# EAGLE design breakout (EAGLE 7.5.0)

## Sheet 1 of 2
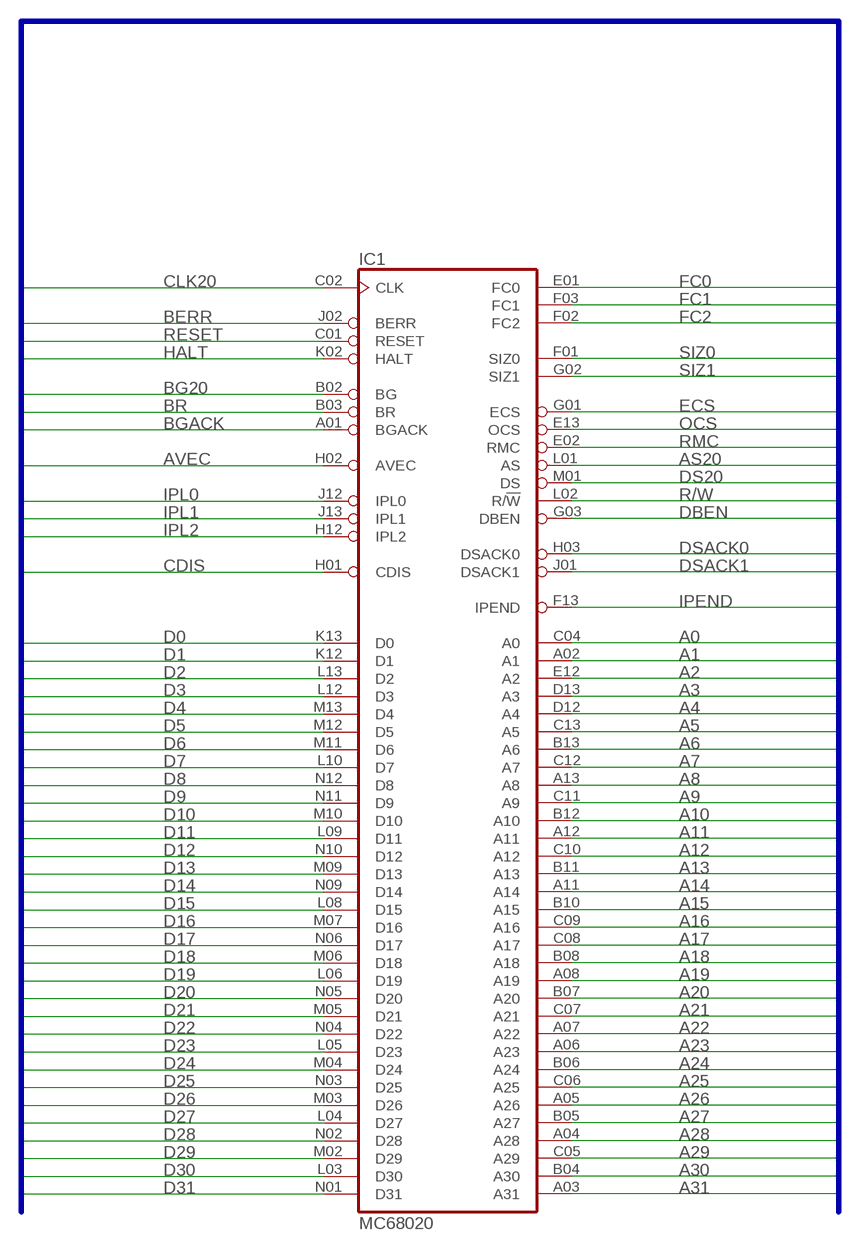
[diagram p0: schematic, sheet 1]

### Parts
IC1  MC68020  MC68020RC  [MPGA114]

### Nets
A0: IC1.C04(A0) ; also sheet 2
A1: IC1.A02(A1) ; also sheet 2
A2: IC1.E12(A2) ; also sheet 2
A3: IC1.D13(A3) ; also sheet 2
A4: IC1.D12(A4) ; also sheet 2
A5: IC1.C13(A5) ; also sheet 2
A6: IC1.B13(A6) ; also sheet 2
A7: IC1.C12(A7) ; also sheet 2
A8: IC1.A13(A8) ; also sheet 2
A9: IC1.C11(A9) ; also sheet 2
A10: IC1.B12(A10) ; also sheet 2
A11: IC1.A12(A11) ; also sheet 2
A12: IC1.C10(A12) ; also sheet 2
A13: IC1.B11(A13) ; also sheet 2
A14: IC1.A11(A14) ; also sheet 2
A15: IC1.B10(A15) ; also sheet 2
A16: IC1.C09(A16) ; also sheet 2
A17: IC1.C08(A17) ; also sheet 2
A18: IC1.B08(A18) ; also sheet 2
A19: IC1.A08(A19) ; also sheet 2
A20: IC1.B07(A20) ; also sheet 2
A21: IC1.C07(A21) ; also sheet 2
A22: IC1.A07(A22) ; also sheet 2
A23: IC1.A06(A23) ; also sheet 2
A24: IC1.B06(A24) ; also sheet 2
A25: IC1.C06(A25) ; also sheet 2
A26: IC1.A05(A26) ; also sheet 2
A27: IC1.B05(A27) ; also sheet 2
A28: IC1.A04(A28) ; also sheet 2
A29: IC1.C05(A29) ; also sheet 2
A30: IC1.B04(A30) ; also sheet 2
A31: IC1.A03(A31) ; also sheet 2
AS20: IC1.L01(AS) ; also sheet 2
AVEC: IC1.H02(AVEC) ; also sheet 2
BERR: IC1.J02(BERR) ; also sheet 2
BG20: IC1.B02(BG) ; also sheet 2
BGACK: IC1.A01(BGACK) ; also sheet 2
BR: IC1.B03(BR) ; also sheet 2
CDIS: IC1.H01(CDIS) ; also sheet 2
CLK20: IC1.C02(CLK) ; also sheet 2
D0: IC1.K13(D0) ; also sheet 2
D1: IC1.K12(D1) ; also sheet 2
D2: IC1.L13(D2) ; also sheet 2
D3: IC1.L12(D3) ; also sheet 2
D4: IC1.M13(D4) ; also sheet 2
D5: IC1.M12(D5) ; also sheet 2
D6: IC1.M11(D6) ; also sheet 2
D7: IC1.L10(D7) ; also sheet 2
D8: IC1.N12(D8) ; also sheet 2
D9: IC1.N11(D9) ; also sheet 2
D10: IC1.M10(D10) ; also sheet 2
D11: IC1.L09(D11) ; also sheet 2
D12: IC1.N10(D12) ; also sheet 2
D13: IC1.M09(D13) ; also sheet 2
D14: IC1.N09(D14) ; also sheet 2
D15: IC1.L08(D15) ; also sheet 2
D16: IC1.M07(D16) ; also sheet 2
D17: IC1.N06(D17) ; also sheet 2
D18: IC1.M06(D18) ; also sheet 2
D19: IC1.L06(D19) ; also sheet 2
D20: IC1.N05(D20) ; also sheet 2
D21: IC1.M05(D21) ; also sheet 2
D22: IC1.N04(D22) ; also sheet 2
D23: IC1.L05(D23) ; also sheet 2
D24: IC1.M04(D24) ; also sheet 2
D25: IC1.N03(D25) ; also sheet 2
D26: IC1.M03(D26) ; also sheet 2
D27: IC1.L04(D27) ; also sheet 2
D28: IC1.N02(D28) ; also sheet 2
D29: IC1.M02(D29) ; also sheet 2
D30: IC1.L03(D30) ; also sheet 2
D31: IC1.N01(D31) ; also sheet 2
DBEN: IC1.G03(DBEN) ; also sheet 2
DS20: IC1.M01(DS) ; also sheet 2
DSACK0: IC1.H03(DSACK0) ; also sheet 2
DSACK1: IC1.J01(DSACK1) ; also sheet 2
ECS: IC1.G01(ECS) ; also sheet 2
FC0: IC1.E01(FC0) ; also sheet 2
FC1: IC1.F03(FC1) ; also sheet 2
FC2: IC1.F02(FC2) ; also sheet 2
HALT: IC1.K02(HALT) ; also sheet 2
IPEND: IC1.F13(IPEND) ; also sheet 2
IPL0: IC1.J12(IPL0) ; also sheet 2
IPL1: IC1.J13(IPL1) ; also sheet 2
IPL2: IC1.H12(IPL2) ; also sheet 2
OCS: IC1.E13(OCS) ; also sheet 2
R/W: IC1.L02(R/!W) ; also sheet 2
RESET: IC1.C01(RESET) ; also sheet 2
RMC: IC1.E02(RMC) ; also sheet 2
SIZ0: IC1.F01(SIZ0) ; also sheet 2
SIZ1: IC1.G02(SIZ1) ; also sheet 2

### Buses
VCC33,VCC,GND,CLK7M,A[0..31],D[0..31],IPL[0..2],FC[0..2],DSACK[0..1],BR,BGACK,R/W,CLK20,AS20,DS20,BG20,AVEC,SIZ[0..1],DBEN,BERR,RESET,HALT,BG,VPA,VMA,E,AS,CDIS,UDS,LDS,DTACK,ECS,OCS,RMC,IPEND

## Sheet 2 of 2
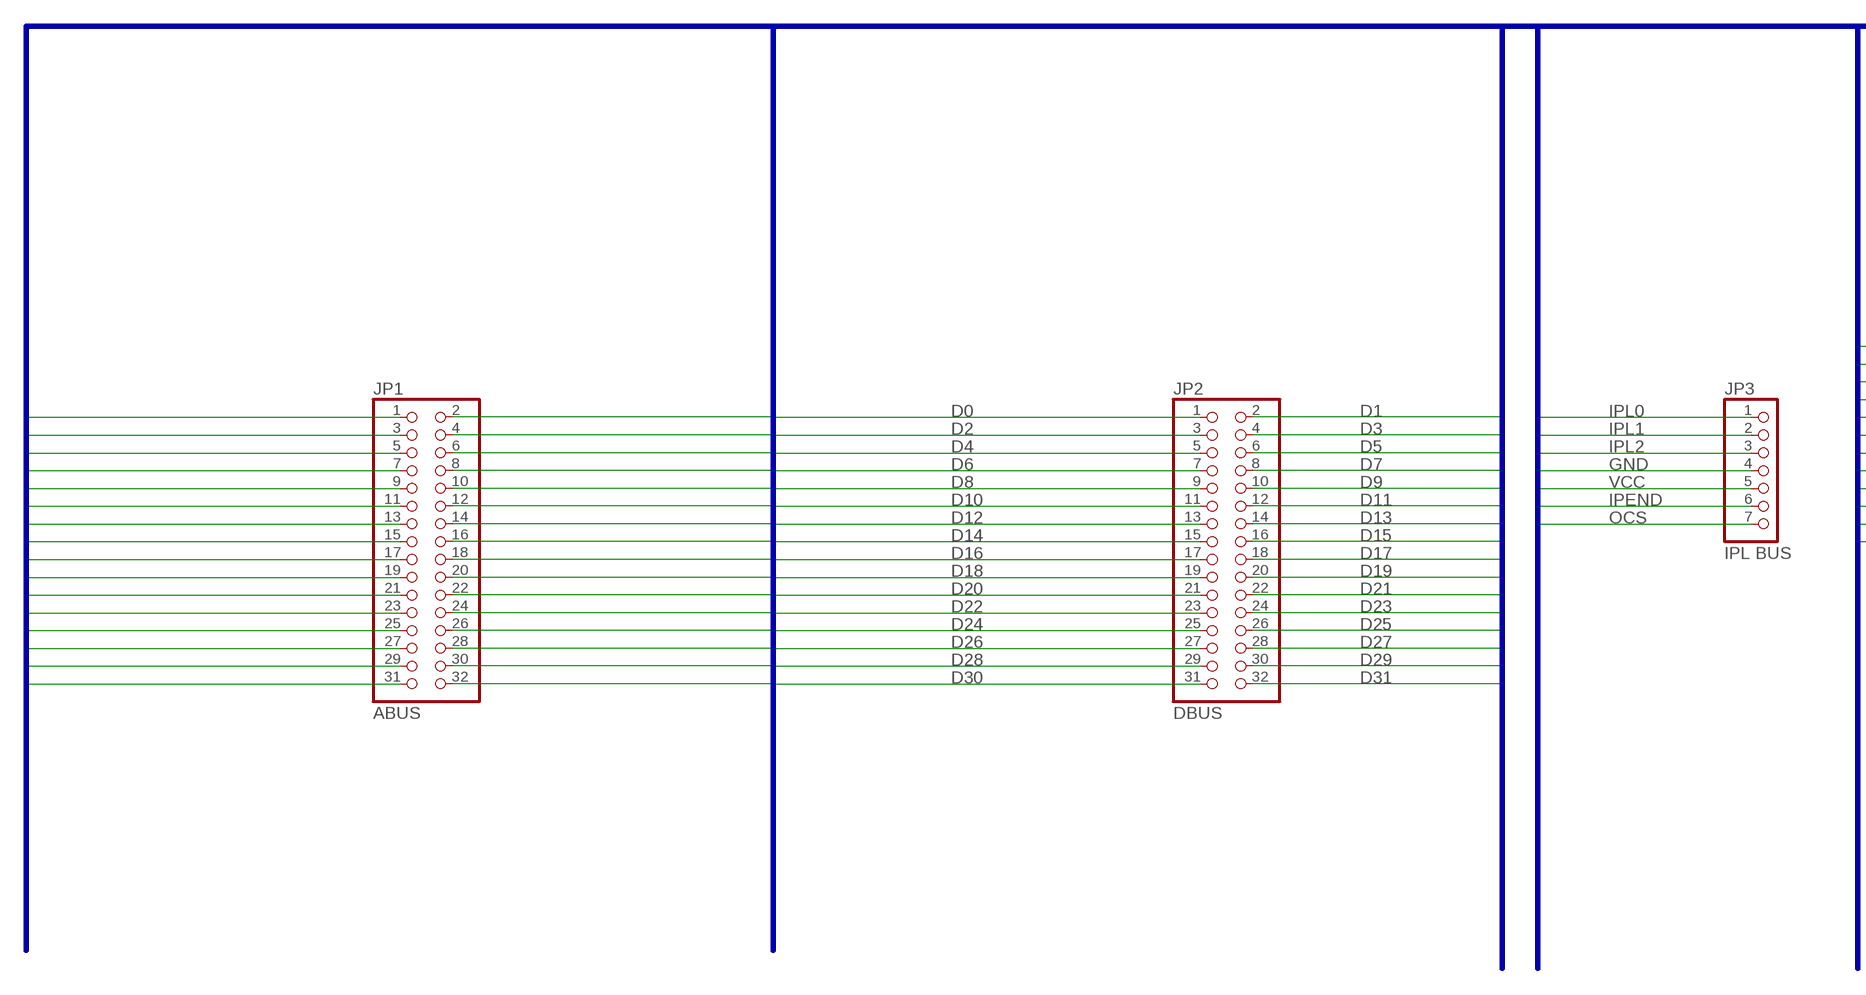
[diagram p1: schematic, sheet 2, part 1 of 2]
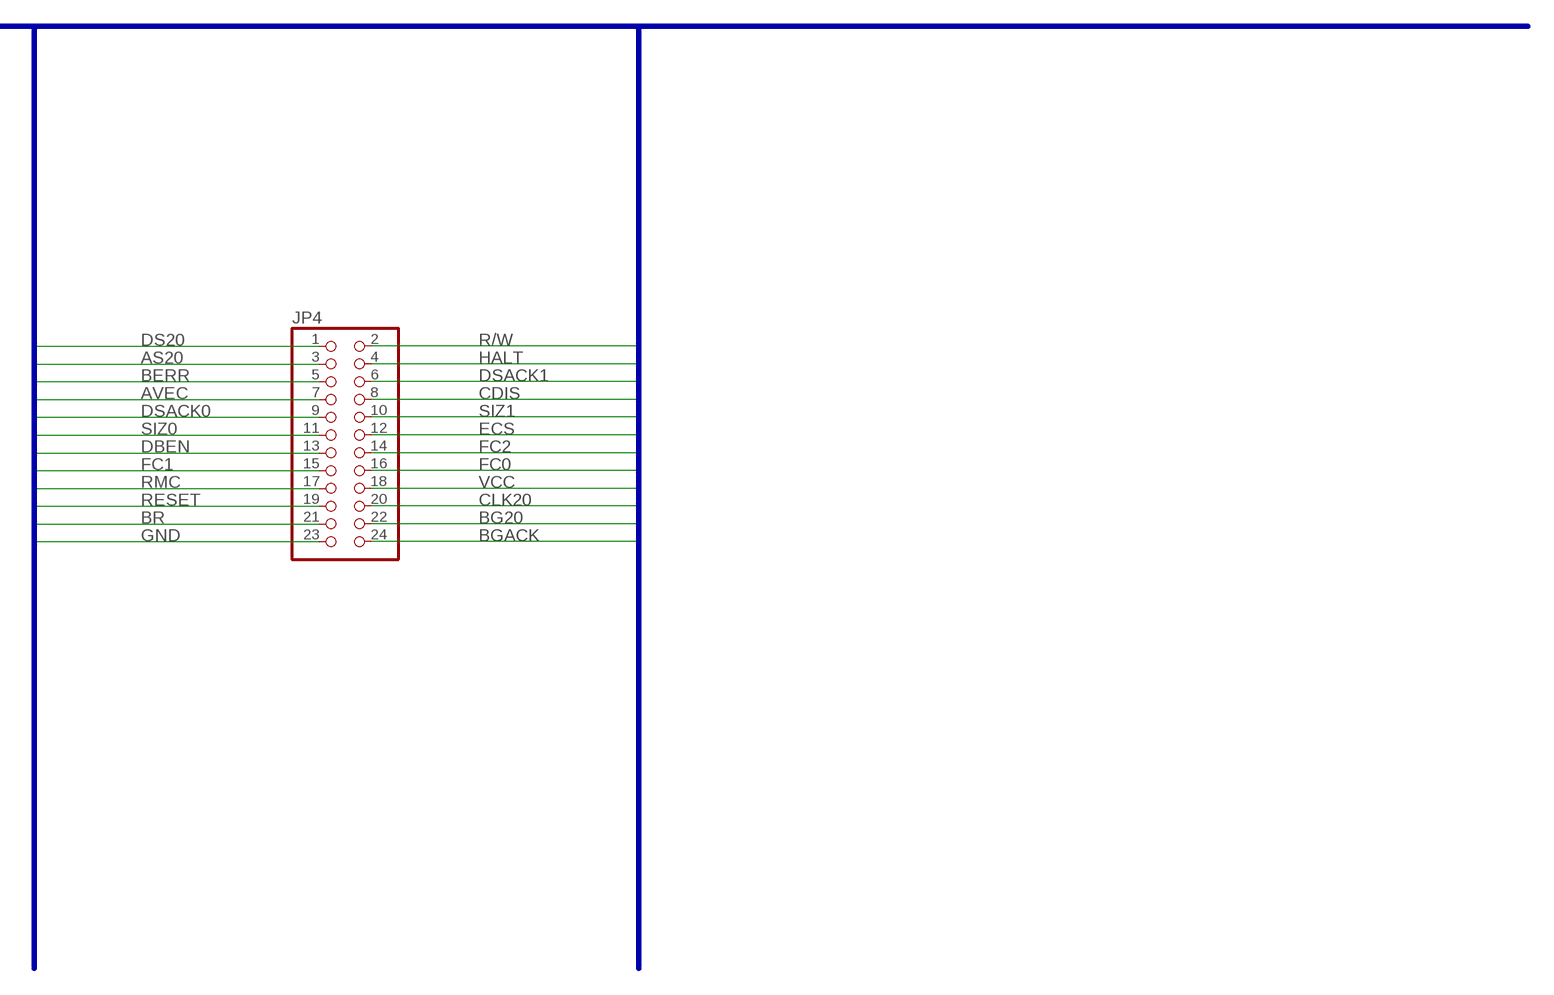
[diagram p2: schematic, sheet 2, part 2 of 2]

### Parts
JP1  ABUS  PINHD-2X16  [2X16]
JP2  DBUS  PINHD-2X16  [2X16]
JP3  IPL BUS  PINHD-1X7  [1X07]
JP4  PINHD-2X12  [2X12]

### Nets
A0: JP1.1 ; also sheet 1
A1: JP1.2 ; also sheet 1
A2: JP1.3 ; also sheet 1
A3: JP1.4 ; also sheet 1
A4: JP1.5 ; also sheet 1
A5: JP1.6 ; also sheet 1
A6: JP1.7 ; also sheet 1
A7: JP1.8 ; also sheet 1
A8: JP1.9 ; also sheet 1
A9: JP1.10 ; also sheet 1
A10: JP1.11 ; also sheet 1
A11: JP1.12 ; also sheet 1
A12: JP1.13 ; also sheet 1
A13: JP1.14 ; also sheet 1
A14: JP1.15 ; also sheet 1
A15: JP1.16 ; also sheet 1
A16: JP1.17 ; also sheet 1
A17: JP1.18 ; also sheet 1
A18: JP1.19 ; also sheet 1
A19: JP1.20 ; also sheet 1
A20: JP1.21 ; also sheet 1
A21: JP1.22 ; also sheet 1
A22: JP1.23 ; also sheet 1
A23: JP1.24 ; also sheet 1
A24: JP1.25 ; also sheet 1
A25: JP1.26 ; also sheet 1
A26: JP1.27 ; also sheet 1
A27: JP1.28 ; also sheet 1
A28: JP1.29 ; also sheet 1
A29: JP1.30 ; also sheet 1
A30: JP1.31 ; also sheet 1
A31: JP1.32 ; also sheet 1
AS20: JP4.3 ; also sheet 1
AVEC: JP4.7 ; also sheet 1
BERR: JP4.5 ; also sheet 1
BG20: JP4.22 ; also sheet 1
BGACK: JP4.24 ; also sheet 1
BR: JP4.21 ; also sheet 1
CDIS: JP4.8 ; also sheet 1
CLK20: JP4.20 ; also sheet 1
D0: JP2.1 ; also sheet 1
D1: JP2.2 ; also sheet 1
D2: JP2.3 ; also sheet 1
D3: JP2.4 ; also sheet 1
D4: JP2.5 ; also sheet 1
D5: JP2.6 ; also sheet 1
D6: JP2.7 ; also sheet 1
D7: JP2.8 ; also sheet 1
D8: JP2.9 ; also sheet 1
D9: JP2.10 ; also sheet 1
D10: JP2.11 ; also sheet 1
D11: JP2.12 ; also sheet 1
D12: JP2.13 ; also sheet 1
D13: JP2.14 ; also sheet 1
D14: JP2.15 ; also sheet 1
D15: JP2.16 ; also sheet 1
D16: JP2.17 ; also sheet 1
D17: JP2.18 ; also sheet 1
D18: JP2.19 ; also sheet 1
D19: JP2.20 ; also sheet 1
D20: JP2.21 ; also sheet 1
D21: JP2.22 ; also sheet 1
D22: JP2.23 ; also sheet 1
D23: JP2.24 ; also sheet 1
D24: JP2.25 ; also sheet 1
D25: JP2.26 ; also sheet 1
D26: JP2.27 ; also sheet 1
D27: JP2.28 ; also sheet 1
D28: JP2.29 ; also sheet 1
D29: JP2.30 ; also sheet 1
D30: JP2.31 ; also sheet 1
D31: JP2.32 ; also sheet 1
DBEN: JP4.13 ; also sheet 1
DS20: JP4.1 ; also sheet 1
DSACK0: JP4.9 ; also sheet 1
DSACK1: JP4.6 ; also sheet 1
ECS: JP4.12 ; also sheet 1
FC0: JP4.16 ; also sheet 1
FC1: JP4.15 ; also sheet 1
FC2: JP4.14 ; also sheet 1
GND: JP3.4 JP4.23
HALT: JP4.4 ; also sheet 1
IPEND: JP3.6 ; also sheet 1
IPL0: JP3.1 ; also sheet 1
IPL1: JP3.2 ; also sheet 1
IPL2: JP3.3 ; also sheet 1
OCS: JP3.7 ; also sheet 1
R/W: JP4.2 ; also sheet 1
RESET: JP4.19 ; also sheet 1
RMC: JP4.17 ; also sheet 1
SIZ0: JP4.11 ; also sheet 1
SIZ1: JP4.10 ; also sheet 1
VCC: JP3.5 JP4.18

### Buses
VCC33,VCC,GND,CLK7M,A[0..31],D[0..31],IPL[0..2],FC[0..2],DSACK[0..1],BR,BGACK,R/W,CLK20,AS20,DS20,BG20,AVEC,SIZ[0..1],DBEN,BERR,RESET,HALT,BG,VPA,VMA,E,AS,CDIS,UDS,LDS,DTACK,ECS,OCS,RMC,IPEND

## Power pins joined to a net without a drawn wire
GND: IC1.A10(GND) IC1.B01(GND) IC1.B09(GND) IC1.C03(GND) IC1.F12(GND) IC1.G12(GND) IC1.H13(GND) IC1.J03(GND) IC1.K01(GND) IC1.K03(GND) IC1.L07(GND) IC1.L11(GND) IC1.N07(GND)
VCC: IC1.A09(VCC) IC1.D01(VCC) IC1.D02(VCC) IC1.D03(VCC) IC1.E03(VCC) IC1.G11(VCC) IC1.G13(VCC) IC1.M08(VCC) IC1.N08(VCC) IC1.N13(VCC)

## Library data of the parts
IC1 = micro-mc68000:MC68020RC: 68xxx PROCESSOR; MF: MOTOROLA; MPN: MC68020RC33E; OC_FARNELL: 1579779; OC_NEWARK: 66F7091
JP1 JP2 = pinhead:PINHD-2X16: PIN HEADER
JP3 = pinhead:PINHD-1X7: PIN HEADER
JP4 = pinhead:PINHD-2X12: PIN HEADER

## Board
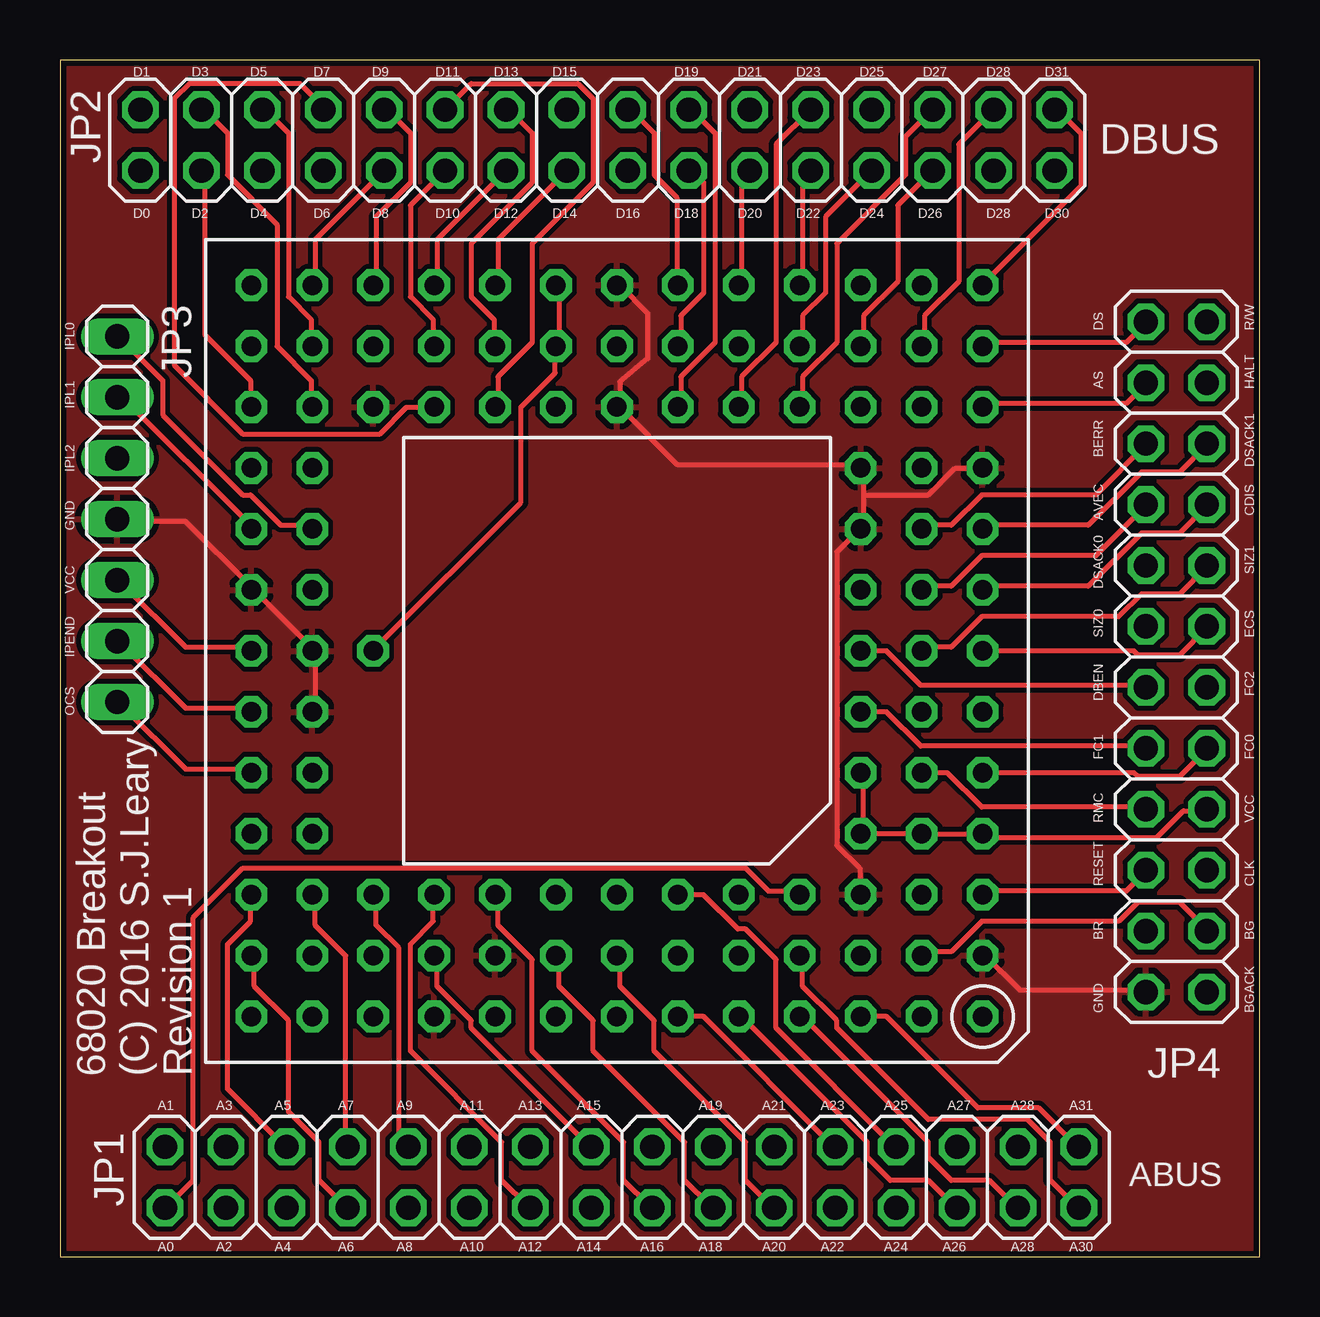
[diagram p3: board, top side]
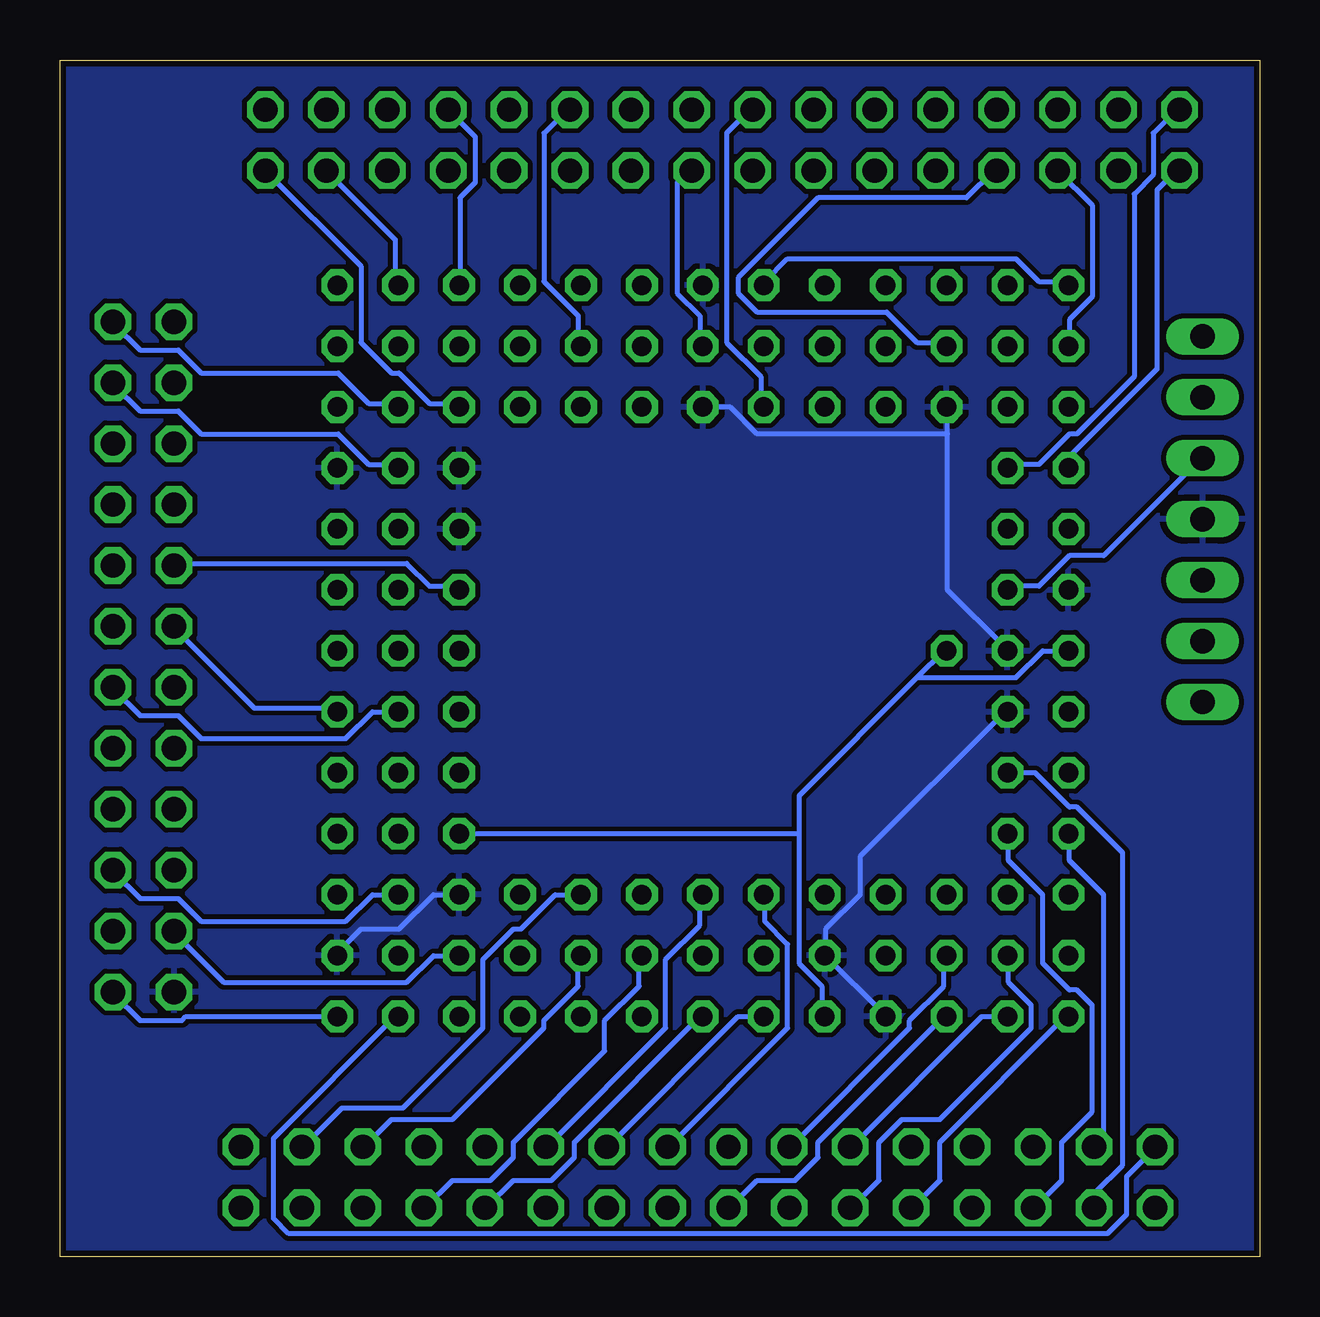
[diagram p4: board, bottom side, seen from below]

Size 50.01 x 49.88 mm. Coordinates in mm from the lower left corner, seen from the top.
Outline: 0,0 50.01,0 50.01,49.88 0,49.88 0,0
Copper layers (1*16): Top 0.035mm / dielectric 1.5mm / Bottom 0.035mm
Design rules "dirt_cheap_dirty_boards.v1 *": minimum track width 5mil, minimum drill 12mil, track to track 8mil, track to pad 8mil, pad to pad 8mil, via to via 8mil, smd to smd 0mil, copper to edge 10mil, drill to drill 10mil, minimum pad ring 10mil, minimum via ring 6mil, stop-mask expansion 2mil, vias tented up to drill 25mil, thermal gap 10mil

### Footprints (pad centres in the part's own frame; a part is rotated, then mirrored left to right if it is on the bottom)
MPGA114 = drill 0.813 octagon: A01 -15.24,15.24; A02 -12.7,15.24; A03 -10.16,15.24; A04 -7.62,15.24; A05 -5.08,15.24; A06 -2.54,15.24; A07 0,15.24; A08 2.54,15.24; A09 5.08,15.24; A10 7.62,15.24; A11 10.16,15.24; A12 12.7,15.24; A13 15.24,15.24; B01 -15.24,12.7; B02 -12.7,12.7; B03 -10.16,12.7; B04 -7.62,12.7; B05 -5.08,12.7; B06 -2.54,12.7; B07 0,12.7; B08 2.54,12.7; B09 5.08,12.7; B10 7.62,12.7; B11 10.16,12.7; B12 12.7,12.7; B13 15.24,12.7; C01 -15.24,10.16; C02 -12.7,10.16; C03 -10.16,10.16; C04 -7.62,10.16; C05 -5.08,10.16; C06 -2.54,10.16; C07 0,10.16; C08 2.54,10.16; C09 5.08,10.16; C10 7.62,10.16; C11 10.16,10.16; C12 12.7,10.16; C13 15.24,10.16; D01 -15.24,7.62; D02 -12.7,7.62; D03 -10.16,7.62; D12 12.7,7.62; D13 15.24,7.62; E01 -15.24,5.08; E02 -12.7,5.08; E03 -10.16,5.08; E12 12.7,5.08; E13 15.24,5.08; F01 -15.24,2.54; F02 -12.7,2.54; F03 -10.16,2.54; F12 12.7,2.54; F13 15.24,2.54; G01 -15.24,0; G02 -12.7,0; G03 -10.16,0; G11 10.16,0; G12 12.7,0; G13 15.24,0; H01 -15.24,-2.54; H02 -12.7,-2.54; H03 -10.16,-2.54; H12 12.7,-2.54; H13 15.24,-2.54; J01 -15.24,-5.08; J02 -12.7,-5.08; J03 -10.16,-5.08; J12 12.7,-5.08; J13 15.24,-5.08; K01 -15.24,-7.62; K02 -12.7,-7.62; K03 -10.16,-7.62; K12 12.7,-7.62; K13 15.24,-7.62; L01 -15.24,-10.16; L02 -12.7,-10.16; L03 -10.16,-10.16; L04 -7.62,-10.16; L05 -5.08,-10.16; L06 -2.54,-10.16; L07 0,-10.16; L08 2.54,-10.16; L09 5.08,-10.16; L10 7.62,-10.16; L11 10.16,-10.16; L12 12.7,-10.16; L13 15.24,-10.16; M01 -15.24,-12.7; M02 -12.7,-12.7; M03 -10.16,-12.7; M04 -7.62,-12.7; M05 -5.08,-12.7; M06 -2.54,-12.7; M07 0,-12.7; M08 2.54,-12.7; M09 5.08,-12.7; M10 7.62,-12.7; M11 10.16,-12.7; M12 12.7,-12.7; M13 15.24,-12.7; N01 -15.24,-15.24; N02 -12.7,-15.24; N03 -10.16,-15.24; N04 -7.62,-15.24; N05 -5.08,-15.24; N06 -2.54,-15.24; N07 0,-15.24; N08 2.54,-15.24; N09 5.08,-15.24; N10 7.62,-15.24; N11 10.16,-15.24; N12 12.7,-15.24; N13 15.24,-15.24
2X16 = drill 1.016 octagon: 1 -19.05,-1.27; 2 -19.05,1.27; 3 -16.51,-1.27; 4 -16.51,1.27; 5 -13.97,-1.27; 6 -13.97,1.27; 7 -11.43,-1.27; 8 -11.43,1.27; 9 -8.89,-1.27; 10 -8.89,1.27; 11 -6.35,-1.27; 12 -6.35,1.27; 13 -3.81,-1.27; 14 -3.81,1.27; 15 -1.27,-1.27; 16 -1.27,1.27; 17 1.27,-1.27; 18 1.27,1.27; 19 3.81,-1.27; 20 3.81,1.27; 21 6.35,-1.27; 22 6.35,1.27; 23 8.89,-1.27; 24 8.89,1.27; 25 11.43,-1.27; 26 11.43,1.27; 27 13.97,-1.27; 28 13.97,1.27; 29 16.51,-1.27; 30 16.51,1.27; 31 19.05,-1.27; 32 19.05,1.27
1X07 = drill 1.016 long: 1 -7.62,0; 2 -5.08,0; 3 -2.54,0; 4 0,0; 5 2.54,0; 6 5.08,0; 7 7.62,0
2X12 = drill 1.016 octagon: 1 -13.97,-1.27; 2 -13.97,1.27; 3 -11.43,-1.27; 4 -11.43,1.27; 5 -8.89,-1.27; 6 -8.89,1.27; 7 -6.35,-1.27; 8 -6.35,1.27; 9 -3.81,-1.27; 10 -3.81,1.27; 11 -1.27,-1.27; 12 -1.27,1.27; 13 1.27,-1.27; 14 1.27,1.27; 15 3.81,-1.27; 16 3.81,1.27; 17 6.35,-1.27; 18 6.35,1.27; 19 8.89,-1.27; 20 8.89,1.27; 21 11.43,-1.27; 22 11.43,1.27; 23 13.97,-1.27; 24 13.97,1.27

### Placement (x,y rotation side)
IC1  23.22,25.25 180 top
JP1  23.42,3.3 0 top
JP2  22.4,46.53 0 top
JP3  2.39,30.73 270 top
JP4  46.53,24.99 270 top

### Tracks (layer width: path | path; a pad name or v marks a point on that pad's centre or on a via)
A0
  Top 0.203: IC1.C04 30.8,15.24 29.53,15.24 28.57,16.19 7.62,16.19 5.56,14.13 5.56,3.17 4.45,2.06 JP1.1
A1
  Bottom 0.203: IC1.A02 36.04,10 41.12,4.92 41.12,1.59 40.48,0.95 6.35,0.95 5.56,1.75 5.56,3.33 4.45,4.45 JP1.2
A2
  Bottom 0.203: IC1.E12 10.48,20.16 9.37,20.16 7.94,18.73 7.62,18.73 5.71,16.83 5.71,3.81 6.83,2.7 6.83,2.06 JP1.3
A3
  Bottom 0.203: IC1.D13 7.94,17.62 7.94,16.51 6.51,15.08 6.51,4.92 6.83,4.6 JP1.4
A4
  Bottom 0.203: IC1.D12 10.48,17.62 10.48,16.51 9.05,15.08 9.05,12.22 7.94,11.11 7.62,11.11 6.99,10.48 6.99,6.03 8.26,4.76 8.26,3.17 9.37,2.06 JP1.5
A5
  Top 0.203: IC1.C13 7.94,15.08 7.94,13.97 6.99,13.02 6.99,6.99 9.37,4.6 JP1.6
A6
  Top 0.203: IC1.B13 8.1,12.54 8.1,11.27 9.53,9.84 9.53,6.03 10.79,4.76 10.79,3.17 11.91,2.06 JP1.7
A7
  Top 0.203: IC1.C12 10.64,15.08 10.64,13.81 11.91,12.54 11.91,4.6 JP1.8
A8
  Bottom 0.203: IC1.A13 8.1,10 13.34,4.76 13.34,3.17 14.45,2.06 JP1.9
A9
  Top 0.203: IC1.C11 13.18,15.08 13.18,13.81 14.13,12.86 14.13,4.92 14.45,4.6 JP1.10
A10
  Bottom 0.203: IC1.B12 10.48,12.54 10.48,11.43 9.53,10.48 9.53,9.53 13.34,5.71 14.92,5.71 15.88,4.76 15.88,3.17 16.99,2.06 JP1.11
A11
  Bottom 0.203: IC1.A12 10.64,10 11.59,10 16.99,4.6 JP1.12
A12
  Top 0.203: IC1.C10 15.56,15.08 15.56,13.97 14.61,13.02 14.61,8.57 18.41,4.76 18.41,3.17 19.53,2.06 JP1.13
A13
  Bottom 0.203: IC1.B11 13.18,12.54 13.18,11.27 14.61,9.84 14.61,9.53 19.53,4.6 JP1.14
A14
  Bottom 0.203: IC1.A11 13.18,10 18.41,4.76 18.41,4.13 19.37,3.17 20.95,3.17 22.07,2.06 JP1.15
A15
  Top 0.203: IC1.B10 15.72,12.54 15.72,11.27 17.14,9.84 17.14,9.53 22.07,4.6 JP1.16
A16
  Top 0.203: IC1.C09 18.26,15.08 18.26,13.81 19.68,12.38 19.68,8.57 23.5,4.76 23.5,3.17 24.61,2.06 JP1.17
A17
  Bottom 0.203: IC1.C08 20.64,15.08 20.64,13.97 19.68,13.02 19.68,9.53 24.61,4.6 JP1.18
A18
  Top 0.203: IC1.B08 20.8,12.54 20.8,11.27 22.23,9.84 22.23,8.57 26.04,4.76 26.04,3.17 27.15,2.06 JP1.19
A19
  Bottom 0.203: IC1.A08 20.8,10 21.75,10 27.15,4.6 JP1.20
A20
  Top 0.203: IC1.B07 23.34,12.54 23.34,11.27 24.77,9.84 24.77,8.57 28.57,4.76 28.57,3.17 29.69,2.06 JP1.21
A21
  Bottom 0.203: IC1.C07 23.34,15.08 23.34,13.81 24.77,12.38 24.77,9.53 29.69,4.6 JP1.22
A22
  Bottom 0.203: IC1.A07 23.34,10 28.57,4.76 28.57,4.13 29.53,3.17 31.11,3.17 32.23,2.06 JP1.23
A23
  Top 0.203: IC1.A06 25.88,10 26.83,10 32.23,4.6 JP1.24
A24
  Bottom 0.203: IC1.B06 25.88,12.54 25.88,11.27 27.3,9.84 27.3,8.57 31.11,4.76 31.11,4.13 32.07,3.17 33.66,3.17 34.77,2.06 JP1.25
A25
  Top 0.203: IC1.C06 25.88,15.08 26.83,15.08 28.26,13.65 28.57,13.65 29.84,12.38 29.84,9.53 34.77,4.6 JP1.26
A26
  Top 0.203: IC1.A05 28.42,10 33.66,4.76 33.66,4.13 34.61,3.17 36.2,3.17 37.31,2.06 JP1.27
A27
  Bottom 0.203: IC1.B05 28.42,12.54 28.42,11.27 29.84,9.84 29.84,9.53 33.66,5.71 36.2,5.71 37.31,4.6 JP1.28
A28
  Top 0.203: IC1.A04 30.96,10 36.2,4.76 36.2,4.13 37.15,3.17 38.73,3.17 39.85,2.06 JP1.29
A29
  Bottom 0.203: IC1.C05 28.42,15.08 29.37,15.08 30.8,13.65 31.11,13.65 32.38,12.38 32.38,9.53 35.72,6.19 38.26,6.19 39.85,4.6 JP1.30
A30
  Top 0.203: IC1.B04 30.96,12.54 30.96,11.27 32.38,9.84 32.38,9.53 36.2,5.71 40.32,5.71 41.27,4.76 41.27,3.17 42.39,2.06 JP1.31
A31
  Top 0.203: IC1.A03 33.5,10 34.45,10 38.26,6.19 40.8,6.19 42.39,4.6 JP1.32
AS20
  Top 0.203: IC1.L01 38.58,35.56 44.45,35.56 45.24,36.35 JP4.3
AVEC
  Top 0.203: IC1.H02 36.04,27.94 37.15,27.94 38.42,29.21 43.18,29.21 45.24,31.27 JP4.7
BERR
  Top 0.203: IC1.J02 36.04,30.48 37.15,30.48 38.42,31.75 43.18,31.75 45.24,33.81 JP4.5
BG20
  Top 0.203: IC1.B02 36.04,12.7 37.15,12.7 38.42,13.97 44.13,13.97 44.93,14.76 46.67,14.76 47.78,13.65 JP4.22
BGACK
  Bottom 0.203: IC1.A01 38.58,10 44.77,10 44.93,9.84 46.67,9.84 47.78,10.95 JP4.24
BR
  Bottom 0.203: IC1.B03 33.5,12.54 34.45,12.54 35.56,11.43 43.18,11.43 45.24,13.49 JP4.21
CDIS
  Top 0.203: IC1.H01 38.58,27.94 42.86,27.94 45.09,30.16 46.67,30.16 47.78,31.27 JP4.8
CLK20
  Bottom 0.203: IC1.C02 36.04,15.08 36.99,15.08 38.1,13.97 44.13,13.97 45.09,14.92 46.67,14.92 47.78,16.03 JP4.20
D0
  Bottom 0.203: IC1.K13 7.94,33.02 7.94,33.34 4.29,36.99 4.29,44.45 3.49,45.24 JP2.1
D1
  Bottom 0.203: IC1.K12 10.48,33.02 9.21,33.02 7.94,34.29 7.62,34.29 5.24,36.67 5.24,44.29 4.45,45.09 4.45,46.83 3.49,47.78 JP2.2
D2
  Top 0.203: IC1.L13 7.94,35.56 7.94,36.51 6.03,38.42 6.03,45.24 JP2.3
D3
  Top 0.203: IC1.L12 10.48,35.56 10.48,36.51 9.05,37.94 9.05,43.02 6.99,45.09 6.99,46.83 6.03,47.78 JP2.4
D4
  Bottom 0.203: JP2.5 6.99,43.81 6.99,40.01 7.94,39.05 7.94,38.1 IC1.M13
D5
  Top 0.203: IC1.M12 10.48,38.1 10.48,39.05 9.53,40.01 9.53,46.83 8.57,47.78 JP2.6
D6
  Bottom 0.203: IC1.M11 13.18,38.1 14.29,38.1 15.56,39.37 20.95,39.37 21.75,40.16 21.75,40.8 18.41,44.13 12.22,44.13 11.11,45.24 JP2.7
D7
  Top 0.203: IC1.L10 15.56,35.4 14.45,35.4 13.34,34.29 7.62,34.29 4.76,37.15 4.76,48.26 5.4,48.9 10,48.9 10.95,47.94 JP2.8
D8
  Top 0.203: JP2.9 10.64,42.39 10.64,40.64 IC1.N12
D9
  Top 0.203: IC1.N11 13.18,40.64 13.18,43.34 14.61,44.77 14.61,46.83 13.65,47.78 JP2.10
D10
  Top 0.203: JP2.11 14.61,43.81 14.61,40.01 15.56,39.05 15.56,38.1 IC1.M10
D11
  Top 0.203: JP2.12 17.14,48.9 21.59,48.9 22.23,48.26 22.23,44.77 19.68,42.23 19.68,38.1 18.26,36.67 18.26,35.56 IC1.L09
D12
  Top 0.203: JP2.13 15.72,42.39 15.72,40.64 IC1.N10
D13
  Top 0.203: IC1.M09 18.1,38.1 18.1,39.05 17.14,40.01 17.14,42.23 19.68,44.77 19.68,46.83 18.73,47.78 JP2.14
D14
  Top 0.203: JP2.15 18.26,42.39 18.26,40.64 IC1.N09
D15
  Bottom 0.203: IC1.L08 20.8,35.56 20.8,36.67 22.23,38.1 22.23,46.83 21.27,47.78 JP2.16
D16
  Bottom 0.203: IC1.M07 23.34,38.1 23.34,39.21 24.29,40.16 24.29,44.77 23.81,45.24 JP2.17
D17
  Top 0.203: IC1.N06 25.72,40.64 25.72,44.13 24.77,45.09 24.77,46.83 23.81,47.78 JP2.18
D18
  Top 0.203: IC1.M06 25.88,38.1 25.88,39.21 26.83,40.16 26.83,44.77 26.35,45.24 JP2.19
D19
  Top 0.203: IC1.L06 25.88,35.56 25.88,36.67 27.3,38.1 27.3,46.83 26.35,47.78 JP2.20
D20
  Top 0.203: JP2.21 28.42,44.93 28.42,40.64 IC1.N05
D21
  Bottom 0.203: IC1.M05 28.42,38.1 28.42,39.21 29.84,40.64 29.84,46.83 28.89,47.78 JP2.22
D22
  Top 0.203: JP2.23 30.96,44.93 30.96,40.64 IC1.N04
D23
  Top 0.203: JP2.24 29.84,46.35 29.84,38.1 28.42,36.67 28.42,35.56 IC1.L05
D24
  Top 0.203: JP2.25 31.91,43.34 31.91,40.16 30.96,39.21 30.96,38.1 IC1.M04
D25
  Bottom 0.203: JP2.26 32.7,46.67 32.7,44.77 33.34,44.13 33.34,40.64 IC1.N03
D26
  Top 0.203: JP2.27 34.92,43.81 34.92,40.64 33.5,39.21 33.5,38.1 IC1.M03
D27
  Top 0.203: JP2.28 35.24,46.67 35.24,45.09 32.38,42.23 32.38,38.1 30.96,36.67 30.96,35.56 IC1.L04
D28
  Bottom 0.203: JP2.29 36.04,42.39 36.04,40.64 IC1.N02
D29
  Top 0.203: JP2.30 37.47,46.35 37.47,40.64 36.04,39.21 36.04,38.1 IC1.M02
D30
  Bottom 0.203: JP2.31 37.47,41.27 37.47,38.1 36.2,36.83 35.88,36.83 34.61,35.56 33.5,35.56 IC1.L03
D31
  Top 0.203: IC1.N01 38.58,40.64 42.55,44.61 42.55,46.83 41.59,47.78 JP2.32
DBEN
  Top 0.203: IC1.G03 33.5,25.24 34.45,25.24 35.88,23.81 45.24,23.81 JP4.13
DS20
  Top 0.203: IC1.M01 38.58,38.1 44.45,38.1 45.24,38.89 JP4.1
DSACK0
  Bottom 0.203: IC1.H03 33.5,27.94 34.61,27.94 35.56,28.89 45.24,28.89 JP4.9
DSACK1
  Top 0.203: IC1.J01 38.58,30.48 42.86,30.48 45.09,32.7 46.67,32.7 47.78,33.81 JP4.6
ECS
  Top 0.203: IC1.G01 38.58,25.24 44.77,25.24 44.93,25.08 46.67,25.08 47.78,26.19 JP4.12
FC0
  Top 0.203: IC1.E01 38.58,20.16 44.77,20.16 44.93,20 46.67,20 47.78,21.11 JP4.16
FC1
  Top 0.203: IC1.F03 33.5,22.7 34.45,22.7 35.88,21.27 45.24,21.27 JP4.15
FC2
  Bottom 0.203: IC1.F02 36.04,22.7 36.99,22.7 38.1,21.59 44.13,21.59 45.09,22.54 46.67,22.54 47.78,23.65 JP4.14
GND
  Top 0.203: JP4.23 45.24,11.11 40.01,11.11 38.58,12.54 IC1.B01 | 33.5,31.75 33.5,32.86 IC1.K03 33.34,33.02 25.72,33.02 23.34,35.4 IC1.L07 23.34,35.56 23.34,36.47 24.49,37.42 24.49,39.33 23.34,40.48 IC1.N07 | 33.5,31.75 33.5,30.48 IC1.J03 33.34,30.32 32.38,29.37 32.38,17.14 33.34,16.19 33.34,15.24 IC1.C03 | 33.5,31.75 36.2,31.75 37.31,32.86 38.42,32.86 IC1.K01 | IC1.F12 10.64,22.86 10.64,25.24 IC1.G12 10.48,25.4 8.1,27.78 IC1.H13 7.94,27.94 5.24,30.64 2.54,30.64 JP3.4
  Bottom 0.203: IC1.C03 33.5,15.08 34.45,15.08 35.88,13.65 37.47,13.65 38.42,12.7 IC1.B01 | IC1.A10 15.72,10.16 18.1,12.54 IC1.B09 18.1,12.7 18.1,13.65 16.67,15.08 16.67,16.67 10.64,22.7 IC1.F12 | 13.02,34.29 13.02,27.78 10.64,25.4 IC1.G12 | 13.02,34.29 13.02,35.4 IC1.L11 | 13.02,34.29 20.95,34.29 22.07,35.4 23.18,35.4 IC1.L07
  pour Bottom: 0,49.78 49.99,49.78 49.99,0 0,0
  pour Top: 0,49.78 49.99,49.78 49.99,0 0,0
HALT
  Bottom 0.203: IC1.K02 36.04,33.02 37.15,33.02 38.42,34.29 44.13,34.29 45.09,35.24 46.67,35.24 47.78,36.35 JP4.4
IPEND
  Top 0.203: IC1.F13 7.94,22.86 5.24,22.86 2.54,25.56 JP3.6
IPL0
  Top 0.203: IC1.J12 10.48,30.48 9.21,30.48 7.94,31.75 7.62,31.75 4.29,35.08 4.29,36.51 2.54,38.26 JP3.1
IPL1
  Top 0.203: IC1.J13 7.94,30.48 2.54,35.88 JP3.2
IPL2
  Bottom 0.203: IC1.H12 10.48,27.94 9.21,27.94 7.94,29.21 6.51,29.21 2.54,33.18 JP3.3
OCS
  Top 0.203: IC1.E13 7.94,20.32 5.24,20.32 2.54,23.02 JP3.7
R/W
  Bottom 0.203: IC1.L02 36.04,35.56 37.15,35.56 38.42,36.83 44.13,36.83 45.09,37.78 46.67,37.78 47.78,38.89 JP4.2
RESET
  Top 0.203: IC1.C01 38.58,15.24 44.45,15.24 45.24,16.03 JP4.19
RMC
  Top 0.203: IC1.E02 36.04,20.16 36.99,20.16 38.42,18.73 45.24,18.73 JP4.17
SIZ0
  Bottom 0.203: IC1.F01 38.58,22.86 41.91,22.86 45.24,26.19 JP4.11
SIZ1
  Top 0.203: IC1.G02 36.04,25.4 37.15,25.4 38.42,26.67 44.13,26.67 45.09,27.62 46.67,27.62 47.78,28.73 JP4.10
VCC
  Top 0.203: IC1.E03 33.5,20.16 33.5,17.78 IC1.D03 33.5,17.62 35.88,17.62 IC1.D02 36.04,17.62 38.42,17.62 IC1.D01 38.58,17.62 38.73,17.46 45.72,17.46 46.83,18.57 47.78,18.57 JP4.18 | IC1.N08 20.8,40.48 20.8,38.1 IC1.M08 20.64,37.94 20.64,36.83 19.21,35.4 19.21,31.43 13.18,25.4 IC1.G11 | IC1.G13 7.94,25.4 5.24,25.4 2.54,28.1 JP3.5
  Bottom 0.203: IC1.N13 8.1,40.64 9.21,40.64 10.16,41.59 19.68,41.59 20.64,40.64 IC1.N08 | 19.21,17.62 19.21,19.21 14.29,24.13 | 19.21,17.62 19.21,12.22 18.26,11.27 18.26,10.16 IC1.A09 | 14.29,24.13 13.18,25.24 IC1.G11 | 14.29,24.13 10.16,24.13 9.05,25.24 8.1,25.24 IC1.G13 | 19.21,17.62 33.34,17.62 IC1.D03

### Text on the board
tNames: D1 | D3 | D5 | D7 | D9 | D11 | D13 | D15 | D19 | D21 | D23 | D25 | D27 | D28 | D31 | D0 | D2 | D4 | D6 | D8 | D10 | D12 | D14 | D16 | D18 | D20 | D22 | D24 | D26 | D28 | D30 | DS | R/W | IPL0 | AS | HALT | IPL1 | IPL2 | BERR | DSACK1 | AVEC | CDIS | GND | VCC | DSACK0 | SIZ1 | SIZ0 | ECS | IPEND | OCS | DBEN | FC2 | FC1 | FC0 | RMC | VCC | RESET | CLK | BR | BG | GND | BGACK | 68020 Breakout / (C) 2016 S.J.Leary / Revision 1 | A1 | A3 | A5 | A7 | A9 | A11 | A13 | A15 | A19 | A21 | A23 | A25 | A27 | A28 | A31 | A0 | A2 | A4 | A6 | A8 | A10 | A12 | A14 | A16 | A18 | A20 | A22 | A24 | A26 | A28 | A30
tValues: D17 | A17